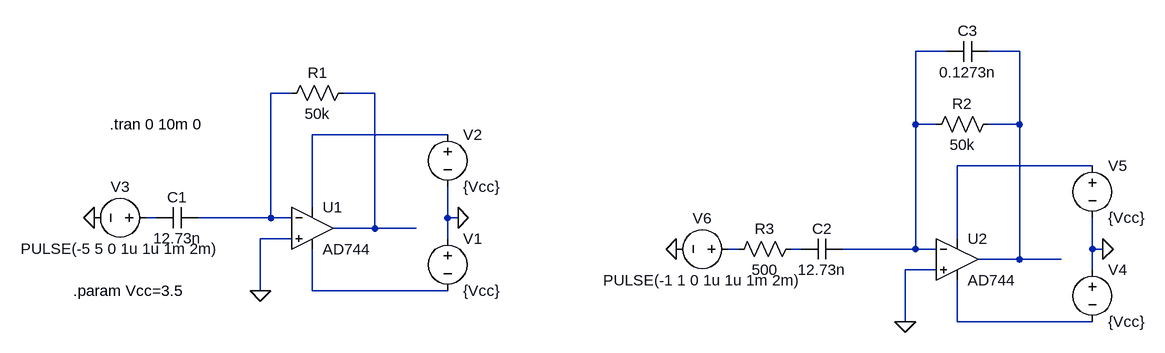
[diagram p0: schematic Draft11.asc]
Draft11.asc, the LTspice schematic file:
Version 4.1
SHEET 1 1472 680
WIRE 1152 -128 1104 -128
WIRE 1264 -128 1216 -128
WIRE 144 -64 112 -64
WIRE 272 -64 224 -64
WIRE 1104 -16 1104 -128
WIRE 1136 -16 1104 -16
WIRE 1264 -16 1264 -128
WIRE 1264 -16 1216 -16
WIRE 384 0 176 0
WIRE 1376 48 1168 48
WIRE 176 112 176 0
WIRE -64 128 -80 128
WIRE 112 128 112 -64
WIRE 112 128 0 128
WIRE 144 128 112 128
WIRE 384 128 384 80
WIRE 400 128 384 128
WIRE 272 144 272 -64
WIRE 272 144 208 144
WIRE 336 144 272 144
WIRE 144 160 96 160
WIRE 384 160 384 128
WIRE 1168 160 1168 48
WIRE 832 176 816 176
WIRE 928 176 912 176
WIRE 1104 176 1104 -16
WIRE 1104 176 992 176
WIRE 1136 176 1104 176
WIRE 1376 176 1376 128
WIRE 1392 176 1376 176
WIRE 1264 192 1264 -16
WIRE 1264 192 1200 192
WIRE 1328 192 1264 192
WIRE 1136 208 1088 208
WIRE 1376 208 1376 176
WIRE 96 240 96 160
WIRE 176 240 176 176
WIRE 384 240 176 240
WIRE 1088 288 1088 208
WIRE 1168 288 1168 224
WIRE 1376 288 1168 288
FLAG 400 128 0
FLAG 96 240 0
FLAG -160 128 0
FLAG 1392 176 0
FLAG 1088 288 0
FLAG 736 176 0
SYMBOL OpAmps\\AD744 176 80 R0
SYMATTR InstName U1
SYMBOL cap 0 112 R90
WINDOW 0 0 32 VBottom 2
WINDOW 3 32 32 VTop 2
SYMATTR InstName C1
SYMATTR Value 12.73n
SYMBOL voltage 384 144 R0
SYMATTR InstName V1
SYMATTR Value {Vcc}
SYMBOL voltage 384 -16 R0
SYMATTR InstName V2
SYMATTR Value {Vcc}
SYMBOL res 240 -80 R90
WINDOW 0 0 56 VBottom 2
WINDOW 3 32 56 VTop 2
SYMATTR InstName R1
SYMATTR Value 50k
SYMBOL voltage -64 128 R90
WINDOW 0 -32 56 VBottom 2
WINDOW 3 32 56 VTop 2
SYMATTR InstName V3
SYMATTR Value PULSE(-5 5 0 1u 1u 1m 2m)
SYMBOL OpAmps\\AD744 1168 128 R0
SYMATTR InstName U2
SYMBOL cap 992 160 R90
WINDOW 0 0 32 VBottom 2
WINDOW 3 32 32 VTop 2
SYMATTR InstName C2
SYMATTR Value 12.73n
SYMBOL voltage 1376 192 R0
SYMATTR InstName V4
SYMATTR Value {Vcc}
SYMBOL voltage 1376 32 R0
SYMATTR InstName V5
SYMATTR Value {Vcc}
SYMBOL res 1232 -32 R90
WINDOW 0 0 56 VBottom 2
WINDOW 3 32 56 VTop 2
SYMATTR InstName R2
SYMATTR Value 50k
SYMBOL res 928 160 R90
WINDOW 0 0 56 VBottom 2
WINDOW 3 32 56 VTop 2
SYMATTR InstName R3
SYMATTR Value 500
SYMBOL voltage 832 176 R90
WINDOW 0 -32 56 VBottom 2
WINDOW 3 32 56 VTop 2
WINDOW 123 0 0 Left 0
WINDOW 39 0 0 Left 0
SYMATTR InstName V6
SYMATTR Value PULSE(-1 1 0 1u 1u 1m 2m)
SYMBOL cap 1216 -144 R90
WINDOW 0 0 32 VBottom 2
WINDOW 3 32 32 VTop 2
SYMATTR InstName C3
SYMATTR Value 0.1273n
TEXT -192 240 Left 2 !.param Vcc=3.5
TEXT -136 -16 Left 2 !.tran 0 10m 0

The netlist it stands for:
* Draft11.asc
X§U1 0 N003 N005 N010 N004 AD744  ; pins In+ In- V+ V- OUT
C1 N003 N007 12.73n
V1 0 N010 {Vcc}
V2 N005 0 {Vcc}
R1 N004 N003 50k
V3 N007 0 PULSE(-5 5 0 1u 1u 1m 2m)
X§U2 0 N001 N006 N011 N002 AD744  ; pins In+ In- V+ V- OUT
C2 N001 N009 12.73n
V4 0 N011 {Vcc}
V5 N006 0 {Vcc}
R2 N002 N001 50k
R3 N009 N008 500
V6 N008 0 PULSE(-1 1 0 1u 1u 1m 2m)
C3 N002 N001 0.1273n
.param Vcc=3.5
.tran 0 10m 0
.backanno
.end